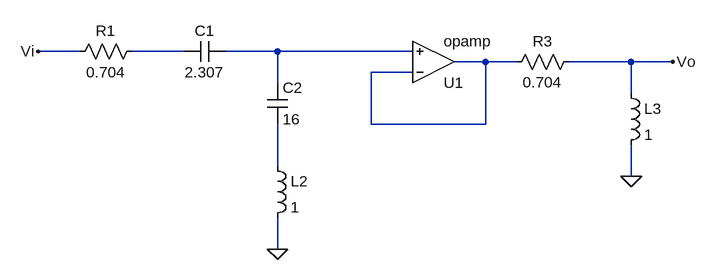
[diagram p0: schematic circuito.asc]
circuito.asc, the LTspice schematic file:
Version 4.1
SHEET 1 880 680
WIRE -128 96 -192 96
WIRE 32 96 -48 96
WIRE 176 96 96 96
WIRE 384 96 176 96
WIRE 496 112 448 112
WIRE 544 112 496 112
WIRE 720 112 624 112
WIRE 784 112 720 112
WIRE 384 128 320 128
WIRE 176 144 176 96
WIRE 720 160 720 112
WIRE 320 208 320 128
WIRE 496 208 496 112
WIRE 496 208 320 208
WIRE 176 272 176 208
WIRE 720 288 720 240
WIRE 176 400 176 352
FLAG 176 400 0
FLAG 720 288 0
FLAG -192 96 Vi
FLAG 784 112 Vo
SYMBOL res -32 80 R90
WINDOW 0 0 56 VBottom 2
WINDOW 3 32 56 VTop 2
SYMATTR InstName R1
SYMATTR Value 0.704
SYMBOL cap 96 80 R90
WINDOW 0 0 32 VBottom 2
WINDOW 3 32 32 VTop 2
SYMATTR InstName C1
SYMATTR Value 2.307
SYMBOL cap 160 144 R0
SYMATTR InstName C2
SYMATTR Value 16
SYMBOL ind 160 256 R0
SYMATTR InstName L2
SYMATTR Value 1
SYMATTR SpiceLine Rser=1m
SYMBOL OpAmps\\opamp 416 176 M180
SYMATTR InstName U1
SYMBOL res 640 96 R90
WINDOW 0 0 56 VBottom 2
WINDOW 3 32 56 VTop 2
SYMATTR InstName R3
SYMATTR Value 0.704
SYMBOL ind 704 144 R0
SYMATTR InstName L3
SYMATTR Value 1
SYMATTR SpiceLine Rser=1m

The netlist it stands for:
* circuito.asc
R1 N001 Vi 0.704
C1 N002 N001 2.307
C2 N002 N004 16
L2 N004 0 1 Rser=1m
X§U1 N003 N002 N003 opamp Aol=100K GBW=10Meg  ; pins invin noninvin out
R3 Vo N003 0.704
L3 Vo 0 1 Rser=1m
.backanno
.end